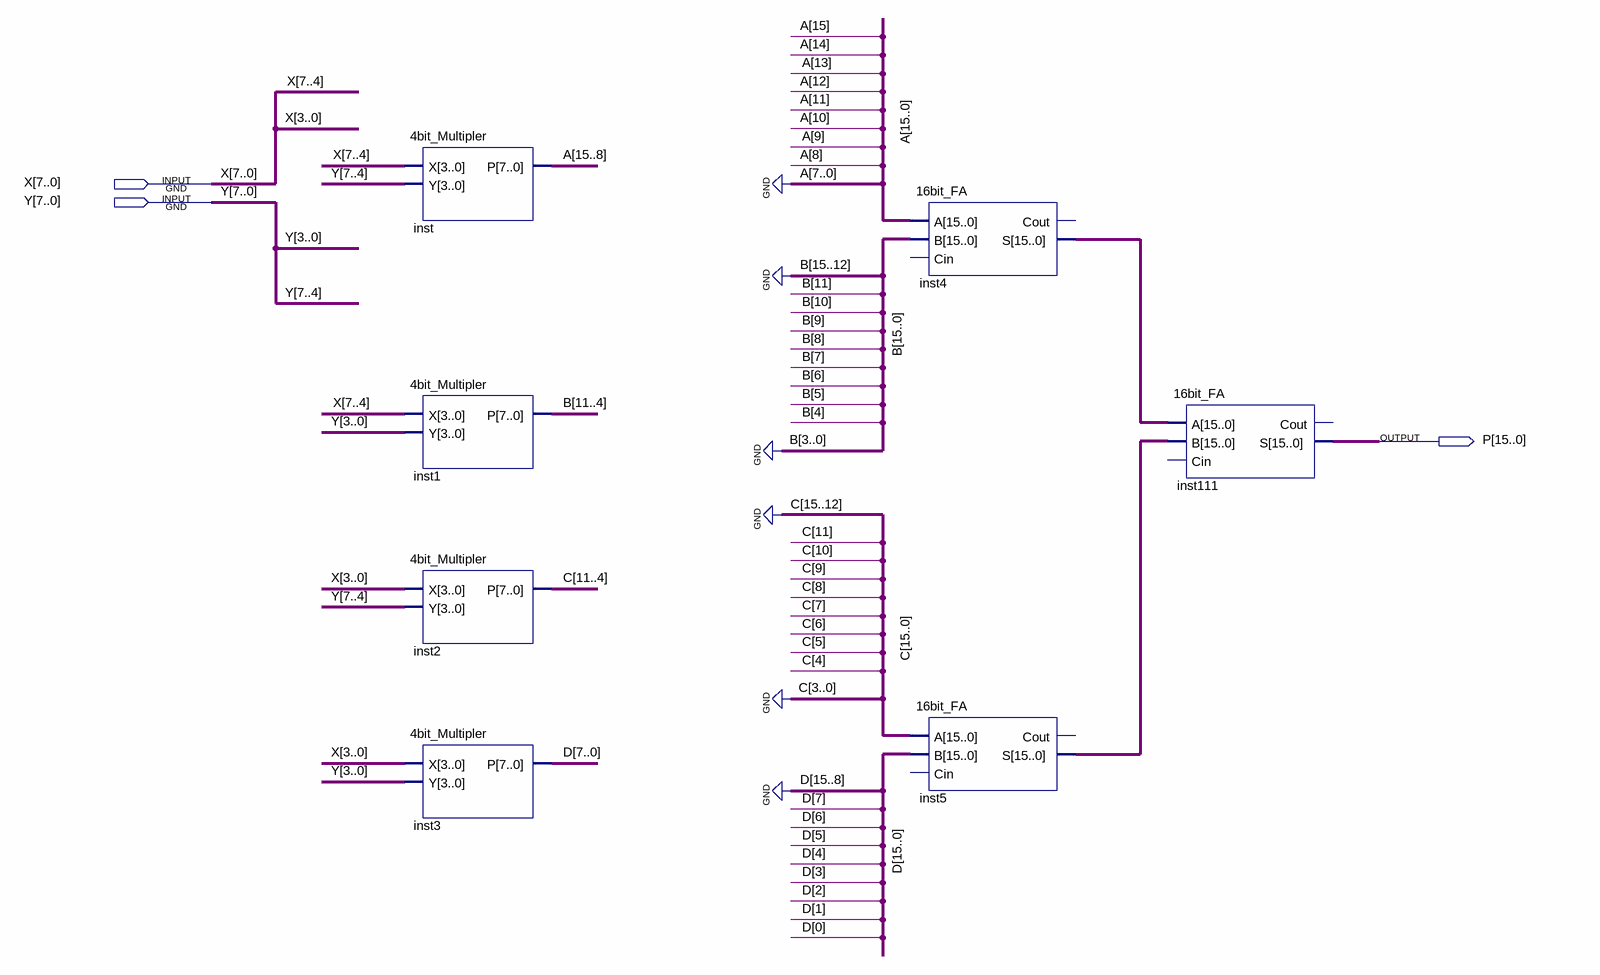
[diagram p0: schematic sheet]
// Quartus schematic 8bit_Multipler.bdf as structural Verilog: 7 symbols, 3 pins
module \8bit_Multipler  (
  input  [7:0] X,
  input  [7:0] Y,
  output [15:0] P
);

  wire [7:0] D;
  wire [11:4] B, C;
  wire [15:0] inst4_s, inst5_s;
  wire [15:8] A;

  \4bit_Multipler  inst (.X(X[7:4]), .Y(Y[7:4]), .P(A));
  \4bit_Multipler  inst1 (.X(X[7:4]), .Y(Y[3:0]), .P(B));
  \4bit_Multipler  inst2 (.X(X[3:0]), .Y(Y[7:4]), .P(C));
  \4bit_Multipler  inst3 (.X(X[3:0]), .Y(Y[3:0]), .P(D));
  \16bit_FA  inst4 (.A({A, {8{1'b0}}}), .B({4'b0000, B, 4'b0000}), .S(inst4_s));  // open: Cin, Cout
  \16bit_FA  inst5 (.A({4'b0000, C, 4'b0000}), .B({{8{1'b0}}, D}), .S(inst5_s));  // open: Cin, Cout
  \16bit_FA  inst111 (.A(inst4_s), .B(inst5_s), .S(P));  // open: Cin, Cout
endmodule
